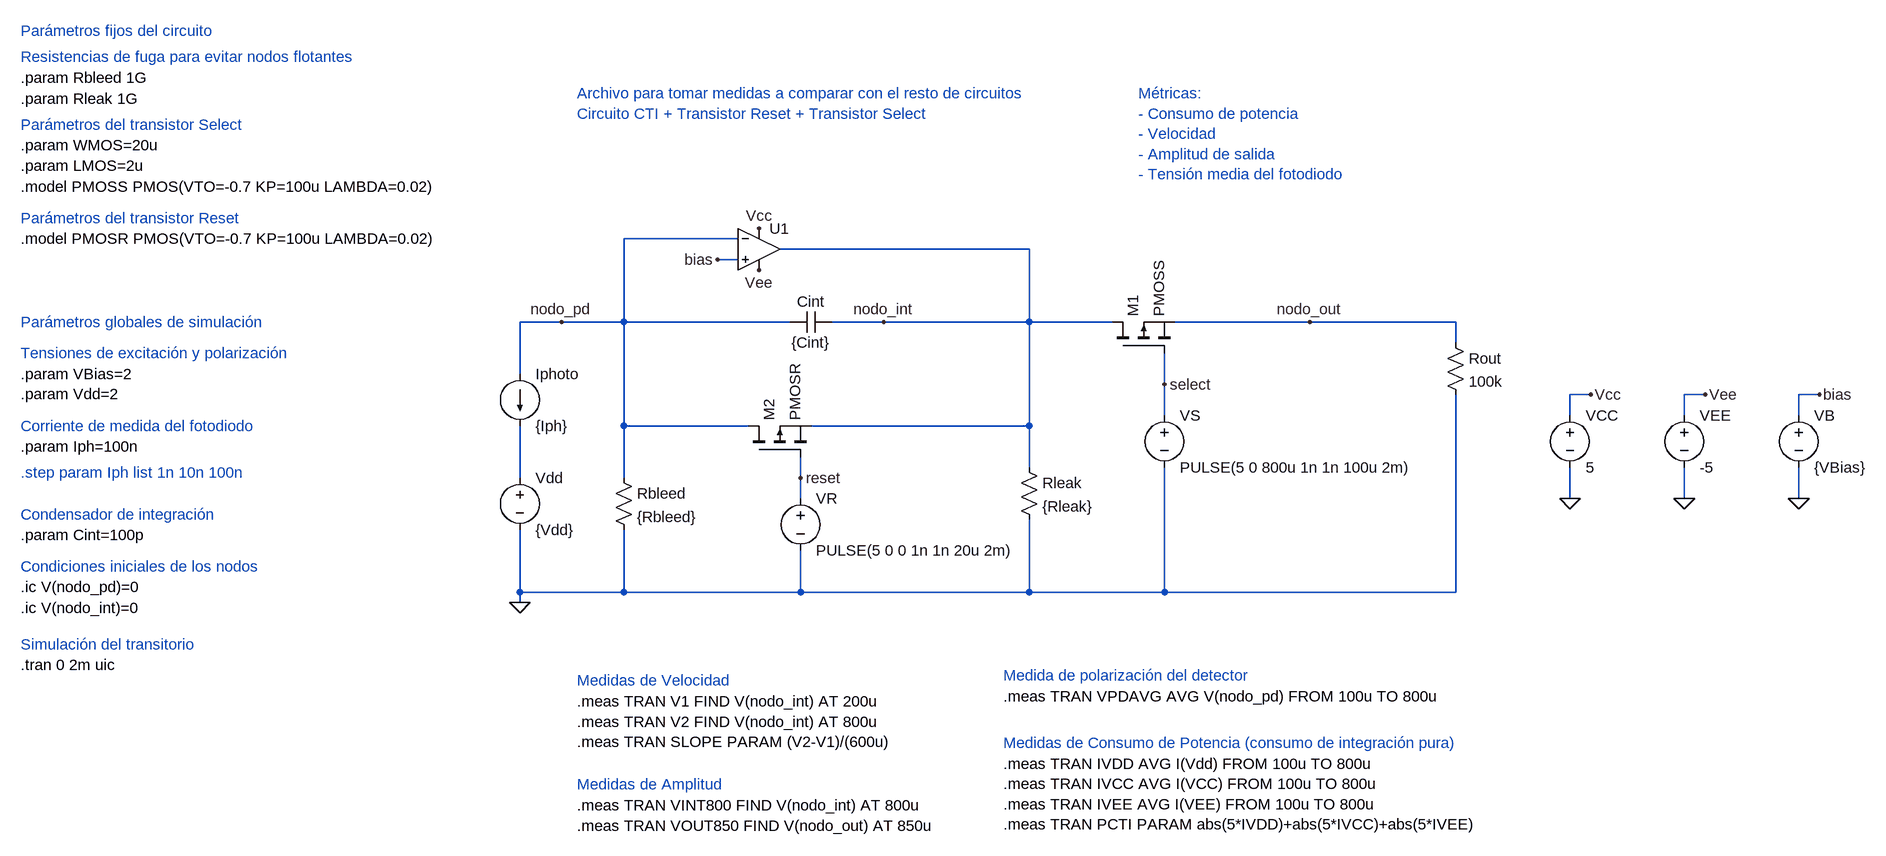
[diagram p0: schematic CTI_Comp.asc]
CTI_Comp.asc, the LTspice schematic file:
Version 4.1
SHEET 1 2360 1580
WIRE 416 384 240 384
WIRE 864 400 480 400
WIRE 416 416 384 416
WIRE 144 512 80 512
WIRE 240 512 240 384
WIRE 240 512 144 512
WIRE 496 512 240 512
WIRE 640 512 560 512
WIRE 864 512 864 400
WIRE 864 512 640 512
WIRE 992 512 864 512
WIRE 1296 512 1088 512
WIRE 1520 512 1296 512
WIRE 1520 544 1520 512
WIRE 80 592 80 512
WIRE 1072 608 1072 560
WIRE 1728 624 1696 624
WIRE 1904 624 1872 624
WIRE 2080 624 2048 624
WIRE 1072 656 1072 608
WIRE 1696 656 1696 624
WIRE 1872 656 1872 624
WIRE 2048 656 2048 624
WIRE 240 672 240 512
WIRE 432 672 240 672
WIRE 864 672 864 512
WIRE 864 672 528 672
WIRE 864 736 864 672
WIRE 80 752 80 672
WIRE 240 752 240 672
WIRE 512 752 512 720
WIRE 512 784 512 752
WIRE 1696 784 1696 736
WIRE 1872 784 1872 736
WIRE 2048 784 2048 736
WIRE 80 928 80 832
WIRE 240 928 240 832
WIRE 240 928 80 928
WIRE 512 928 512 864
WIRE 512 928 240 928
WIRE 864 928 864 816
WIRE 864 928 512 928
WIRE 1072 928 1072 736
WIRE 1072 928 864 928
WIRE 1520 928 1520 624
WIRE 1520 928 1072 928
WIRE 80 944 80 928
FLAG 80 944 0
FLAG 144 512 nodo_pd
FLAG 640 512 nodo_int
FLAG 2080 624 bias
FLAG 1696 784 0
FLAG 1872 784 0
FLAG 1728 624 Vcc
FLAG 1904 624 Vee
FLAG 448 368 Vcc
FLAG 448 432 Vee
FLAG 384 416 bias
FLAG 2048 784 0
FLAG 1072 608 select
FLAG 1296 512 nodo_out
FLAG 512 752 reset
SYMBOL voltage 2048 640 R0
SYMATTR InstName VB
SYMATTR Value {VBias}
SYMBOL current 80 592 R0
SYMATTR InstName Iphoto
SYMATTR Value {Iph}
SYMBOL cap 496 528 R270
WINDOW 0 32 32 VTop 2
WINDOW 3 0 32 VBottom 2
SYMATTR InstName Cint
SYMATTR Value {Cint}
SYMBOL res 224 736 R0
SYMATTR InstName Rbleed
SYMATTR Value {Rbleed}
SYMBOL res 848 720 R0
SYMATTR InstName Rleak
SYMATTR Value {Rleak}
SYMBOL voltage 80 736 R0
SYMATTR InstName Vdd
SYMATTR Value {Vdd}
SYMBOL OpAmps\\UniversalOpAmp2 448 400 R0
SYMATTR InstName U1
SYMBOL voltage 1696 640 R0
SYMATTR InstName VCC
SYMATTR Value 5
SYMBOL voltage 1872 640 R0
SYMATTR InstName VEE
SYMATTR Value -5
SYMBOL pmos 992 560 R270
SYMATTR InstName M1
SYMATTR Value PMOSS
SYMATTR SpiceLine L={LMOS} W={WMOS}
SYMBOL voltage 1072 640 R0
SYMATTR InstName VS
SYMATTR Value PULSE(5 0 800u 1n 1n 100u 2m)
SYMBOL res 1504 528 R0
SYMATTR InstName Rout
SYMATTR Value 100k
SYMBOL pmos 432 720 R270
SYMATTR InstName M2
SYMATTR Value PMOSR
SYMATTR SpiceLine L={LMOS} W={WMOS}
SYMBOL voltage 512 768 R0
SYMATTR InstName VR
SYMATTR Value PULSE(5 0 0 1n 1n 20u 2m)
TEXT -688 560 Left 2 ;Tensiones de excitación y polarización
TEXT -688 592 Left 2 !.param VBias=2\n.param Vdd=2
TEXT -688 672 Left 2 ;Corriente de medida del fotodiodo
TEXT -688 704 Left 2 !.param Iph=100n
TEXT -688 808 Left 2 ;Condensador de integración
TEXT -688 840 Left 2 !.param Cint=100p
TEXT -688 1040 Left 2 !.tran 0 2m uic
TEXT -688 1008 Left 2 ;Simulación del transitorio
TEXT -688 744 Left 2 ;.step param Iph list 1n 10n 100n
TEXT -688 104 Left 2 ;Resistencias de fuga para evitar nodos flotantes
TEXT -688 136 Left 2 !.param Rbleed 1G
TEXT -688 168 Left 2 !.param Rleak 1G
TEXT -688 304 Left 2 !.model PMOSS PMOS(VTO=-0.7 KP=100u LAMBDA=0.02)
TEXT -688 240 Left 2 !.param WMOS=20u\n.param LMOS=2u
TEXT -688 208 Left 2 ;Parámetros del transistor Select
TEXT -688 888 Left 2 ;Condiciones iniciales de los nodos
TEXT -688 920 Left 2 !.ic V(nodo_pd)=0
TEXT -688 952 Left 2 !.ic V(nodo_int)=0
TEXT -688 352 Left 2 ;Parámetros del transistor Reset
TEXT -688 384 Left 2 !.model PMOSR PMOS(VTO=-0.7 KP=100u LAMBDA=0.02)
TEXT 168 160 Left 2 ;Archivo para tomar medidas a comparar con el resto de circuitos\nCircuito CTI + Transistor Reset + Transistor Select
TEXT 1032 160 Left 2 ;Métricas:\n- Consumo de potencia\n- Velocidad\n- Amplitud de salida\n- Tensión media del fotodiodo
TEXT 168 1064 Left 2 ;Medidas de Velocidad
TEXT 168 1096 Left 2 !.meas TRAN V1 FIND V(nodo_int) AT 200u\n.meas TRAN V2 FIND V(nodo_int) AT 800u\n.meas TRAN SLOPE PARAM (V2-V1)/(600u)
TEXT 168 1224 Left 2 ;Medidas de Amplitud
TEXT 168 1256 Left 2 !.meas TRAN VINT800 FIND V(nodo_int) AT 800u\n.meas TRAN VOUT850 FIND V(nodo_out) AT 850u
TEXT 824 1056 Left 2 ;Medida de polarización del detector
TEXT 824 1088 Left 2 !.meas TRAN VPDAVG AVG V(nodo_pd) FROM 100u TO 800u
TEXT 824 1160 Left 2 ;Medidas de Consumo de Potencia (consumo de integración pura)
TEXT -688 64 Left 2 ;Parámetros fijos del circuito
TEXT -688 512 Left 2 ;Parámetros globales de simulación
TEXT 824 1192 Left 2 !.meas TRAN IVDD AVG I(Vdd) FROM 100u TO 800u\n.meas TRAN IVCC AVG I(VCC) FROM 100u TO 800u\n.meas TRAN IVEE AVG I(VEE) FROM 100u TO 800u\n.meas TRAN PCTI PARAM abs(5*IVDD)+abs(5*IVCC)+abs(5*IVEE)

The netlist it stands for:
* CTI_Comp.asc
VB bias 0 {VBias}
Iphoto nodo_pd N001 {Iph}
Cint nodo_pd nodo_int {Cint}
Rbleed nodo_pd 0 {Rbleed}
Rleak nodo_int 0 {Rleak}
Vdd N001 0 {Vdd}
X§U1 bias nodo_pd Vcc Vee nodo_int level2 Avol=1Meg GBW=10Meg Slew=10Meg Ilimit=25m Rail=0 Vos=0 En=0 Enk=0 In=0 Ink=0 Rin=500Meg  ; pins In+ In- V+ V- OUT
VCC Vcc 0 5
VEE Vee 0 -5
M1 nodo_int select nodo_out nodo_out PMOSS L={LMOS} W={WMOS}
VS select 0 PULSE(5 0 800u 1n 1n 100u 2m)
Rout nodo_out 0 100k
M2 nodo_pd reset nodo_int nodo_int PMOSR L={LMOS} W={WMOS}
VR reset 0 PULSE(5 0 0 1n 1n 20u 2m)
.model NMOS NMOS
.model PMOS PMOS
.lib standard.mos
* Tensiones de excitación y polarización
.param VBias=2
.param Vdd=2
* Corriente de medida del fotodiodo
.param Iph=100n
* Condensador de integración
.param Cint=100p
.tran 0 2m uic
* Simulación del transitorio
* .step param Iph list 1n 10n 100n
* Resistencias de fuga para evitar nodos flotantes
.param Rbleed 1G
.param Rleak 1G
.model PMOSS PMOS(VTO=-0.7 KP=100u LAMBDA=0.02)
.param WMOS=20u
.param LMOS=2u
* Parámetros del transistor Select
* Condiciones iniciales de los nodos
.ic V(nodo_pd)=0
.ic V(nodo_int)=0
* Parámetros del transistor Reset
.model PMOSR PMOS(VTO=-0.7 KP=100u LAMBDA=0.02)
* Archivo para tomar medidas a comparar con el resto de circuitos
* Circuito CTI + Transistor Reset + Transistor Select
* Métricas:
* - Consumo de potencia
* - Velocidad
* - Amplitud de salida
* - Tensión media del fotodiodo
* Medidas de Velocidad
.meas TRAN V1 FIND V(nodo_int) AT 200u
.meas TRAN V2 FIND V(nodo_int) AT 800u
.meas TRAN SLOPE PARAM (V2-V1)/(600u)
* Medidas de Amplitud
.meas TRAN VINT800 FIND V(nodo_int) AT 800u
.meas TRAN VOUT850 FIND V(nodo_out) AT 850u
* Medida de polarización del detector
.meas TRAN VPDAVG AVG V(nodo_pd) FROM 100u TO 800u
* Medidas de Consumo de Potencia (consumo de integración pura)
* Parámetros fijos del circuito
* Parámetros globales de simulación
.meas TRAN IVDD AVG I(Vdd) FROM 100u TO 800u
.meas TRAN IVCC AVG I(VCC) FROM 100u TO 800u
.meas TRAN IVEE AVG I(VEE) FROM 100u TO 800u
.meas TRAN PCTI PARAM abs(5*IVDD)+abs(5*IVCC)+abs(5*IVEE)
.lib UniversalOpAmp2.lib
.backanno
.end

* Results of the author's LTspice run, read from the files saved beside the schematic
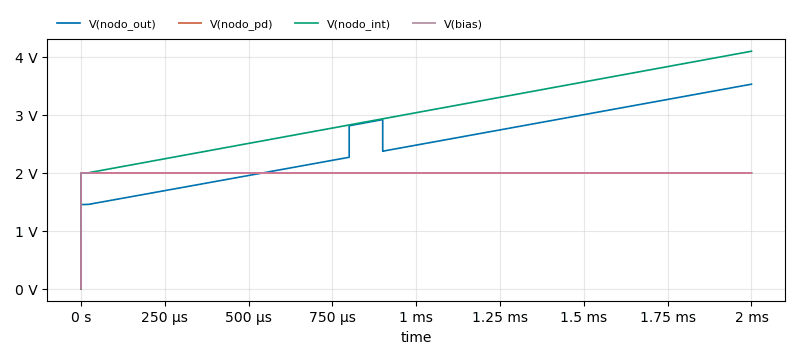
[diagram p1: Transient Analysis of CTI_Comp.asc, plotted from the saved traces]
* Transient Analysis, 1 run:
*   V(nodo_out): min 0 V, max 3.53 V, average 2.507 V, rms 2.581 V, last 3.53 V
*   V(nodo_pd): min 0 V, max 2 V, average 2 V, rms 2 V, last 2 V
*   V(nodo_int): min 0 V, max 4.099 V, average 3.039 V, rms 3.1 V, last 4.099 V
*   V(bias): min 0 V, max 2 V, average 2 V, rms 2 V, last 2 V
* From the log:
*   v1: V(nodo_int) =2.19085362341 at 0.0002
*   v2: V(nodo_int) =2.82683706284 at 0.0008
*   slope: (V2-V1)/(600u)=1059.97239904
*   vint800: V(nodo_int) =2.82683706284 at 0.0008
*   vout850: V(nodo_out) =2.86666828146 at 0.00085
*   vpdavg: AVG(V(nodo_pd) )=1.99998054583 FROM 0.0001 TO 0.0008
*   ivdd: AVG(I(Vdd) )=1.00000001169e-07 FROM 0.0001 TO 0.0008
*   ivcc: AVG(I(VCC) )=-0.000444488476068 FROM 0.0001 TO 0.0008
*   ivee: AVG(I(VEE) )=0.000425379052427 FROM 0.0001 TO 0.0008
*   pcti: abs(5*IVDD)+abs(5*IVCC)+abs(5*IVEE)=0.00434983764248